# EAGLE design Puzzle Serial Bluetooth v0.9b (EAGLE 6.2)
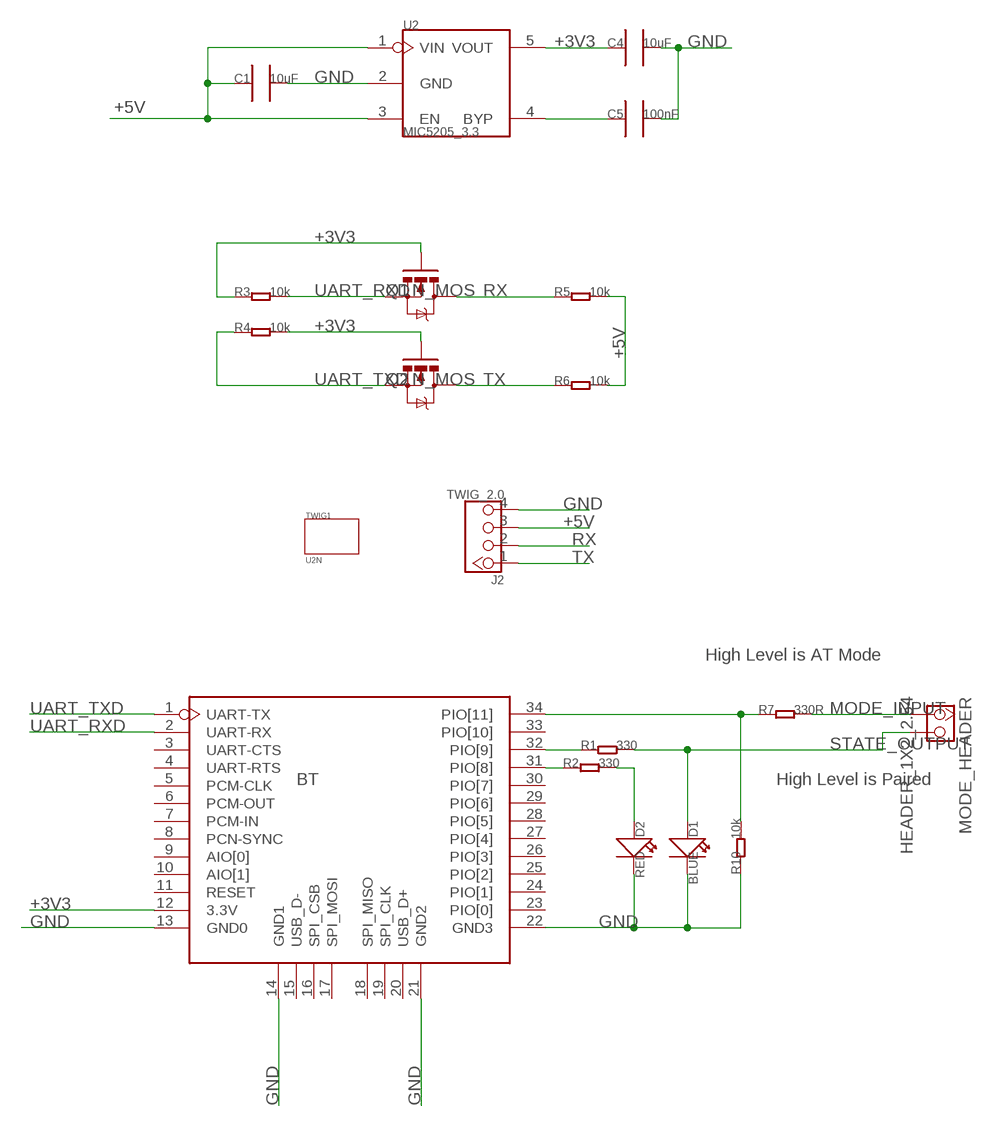
[diagram p0: schematic, sheet 1]

## Parts
BT  SERIAL_BLUETEETHSMT  [SERIAL_BLUETEETH]
C1  10uF  C0805_S  [0805_S]
C4  10uF  C0805_S  [0805_S]
C5  100nF  C0603_S  [0603_S]
D1  BLUE  LED0603_DD  [LED0603]
D2  RED  LED0603_DD  [LED0603]
J2  TWIG_2.0  [2.0_1X4]
MODE_HEADER  HEADER_1X2_2.54  [CK_1*2]
Q1  N_MOS  [SOT23]
Q2  N_MOS  [SOT23]
R1  330  R0603  [0603]
R2  330  R0603  [0603]
R3  10k  R0603_S  [0603_S]
R4  10k  R0603_S  [0603_S]
R5  10k  R0603_S  [0603_S]
R6  10k  R0603_S  [0603_S]
R7  330R  R0603_S  [0603_S]
R10  10k  R0603_S  [0603_S]
TWIG1  U2N  [U2N]
U2  MIC5205_3.3  MIC5025_X.X  [SOT23-5]

## Nets
+3V3: BT.12(3.3V) C4.1 Q1.1(G) Q2.1(G) R3.1 R4.2 U2.5(VOUT)
+5V: C1.1 J2.3 R5.2 R6.2 U2.1(VIN) U2.3(EN)
GND: BT.13(GND0) BT.14(GND1) BT.21(GND2) BT.22(GND3) C1.2 C4.2 C5.2 D1.2(-) D2.2(-) J2.4 R10.1 U2.2(GND)
MODE_INPUT: MODE_HEADER.1 R7.2
N$1: D2.1(+) R2.2
N$3: C5.1 U2.4(BYP)
N$6: BT.34(PIO[11]) R7.1 R10.2
N$7: BT.31(PIO[8]) R2.1
N$8: BT.32(PIO[9]) R1.1
RX: J2.2 Q1.3(D) R5.1
STATE_OUTPUT: D1.1(+) MODE_HEADER.2 R1.2
TX: J2.1 Q2.3(D) R6.1
UART_RXD: BT.2(UART-RX) Q1.2(S) R3.2
UART_TXD: BT.1(UART-TX) Q2.2(S) R4.1
Unconnected: BT.3(UART-CTS) BT.4(UART-RTS) BT.5(PCM-CLK) BT.6(PCM-OUT) BT.7(PCM-IN) BT.8(PCN-SYNC) BT.9(AIO[0]) BT.10(AIO[1]) BT.11(RESET) BT.15(USB_D-) BT.16(SPI_CSB) BT.17(SPI_MOSI) BT.18(SPI_MISO) BT.19(SPI_CLK) BT.20(USB_D+) BT.23(PIO[0]) BT.24(PIO[1]) BT.25(PIO[2]) BT.26(PIO[3]) BT.27(PIO[4]) BT.28(PIO[5]) BT.29(PIO[6]) BT.30(PIO[7]) BT.33(PIO[10])

## Notes on the sheet
- High Level is AT Mode
- High Level is Paired

## Library data of the parts
BT = EXT_moudle:SERIAL_BLUETEETH
C1 C4 = CPT_SMD:C0805
C5 = CPT_SMD:C0603
D1 D2 = CPT_SMD:LED0603
J2 = CONNECTER:TWIG_2.0
MODE_HEADER = CONNECTER:HEADER_1X2
Q1 Q2 = CPT_SMD:N_MOS
R1-R7 R10 = CPT_SMD:R0603
TWIG1 = twig_template1:U2N
U2 = ICs_v54:MIC5025_X.X

## Net classes
0 default: width 0.203 mm, drill 0.305 mm, clearance 0.203 mm

## Board
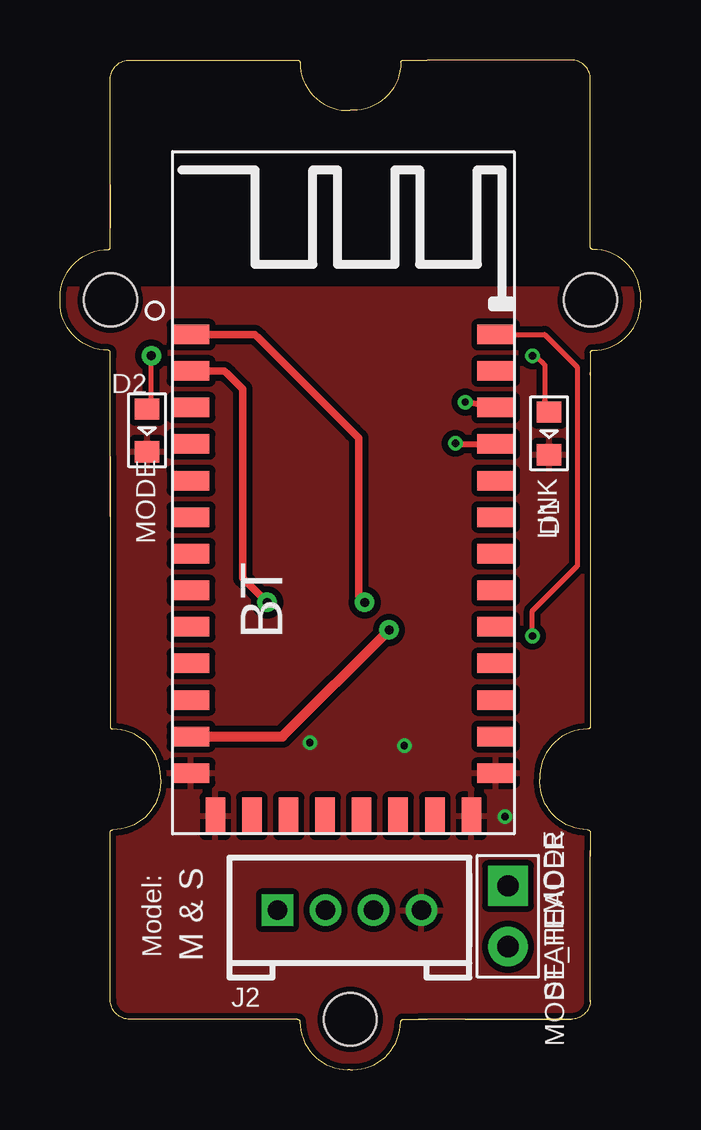
[diagram p1: board, top side]
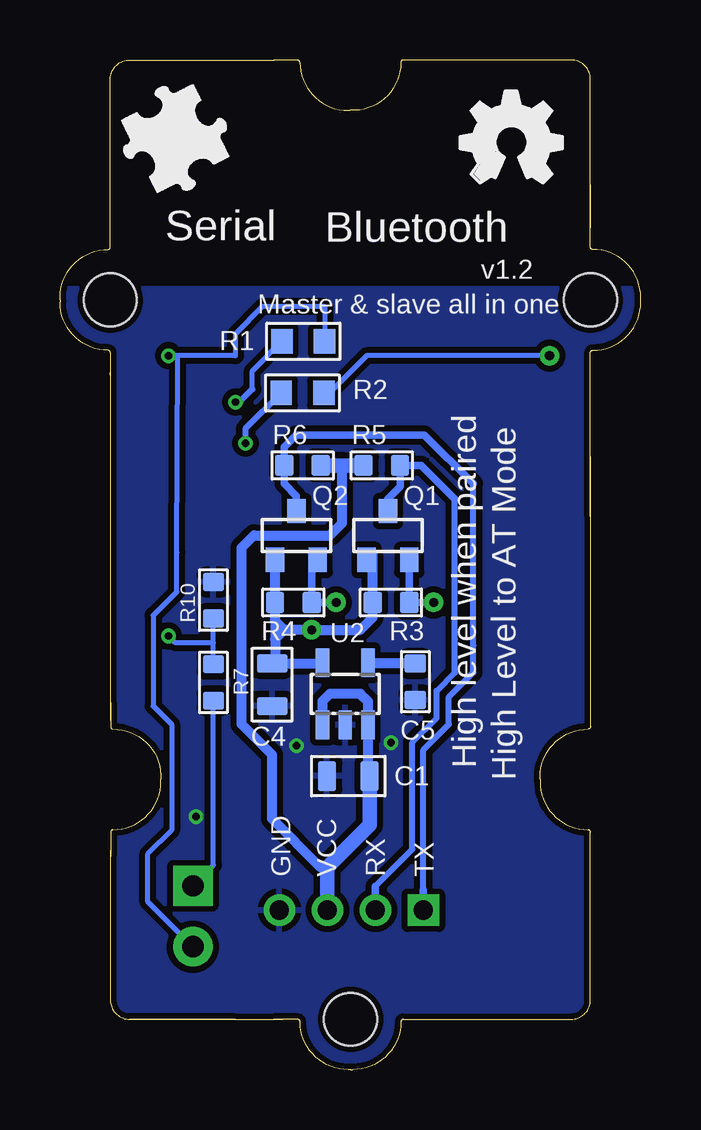
[diagram p2: board, bottom side, seen from below]

Size 24.2 x 42.09 mm. Coordinates in mm from the lower left corner, seen from the top.
Copper layers (1*16): Top 0.035mm / dielectric 1.5mm / Bottom 0.035mm
Design rules: minimum track width 6mil, minimum drill 12mil, track to track 6mil, track to pad 6mil, pad to pad 6mil, via to via 6mil, smd to smd 0mil, copper to edge 10mil, drill to drill 10mil, minimum pad ring 10mil, minimum via ring 6mil, stop-mask expansion 2mil, vias tented up to drill 100mil, thermal gap 10mil

### Footprints (pad centres in the part's own frame; a part is rotated, then mirrored left to right if it is on the bottom)
SERIAL_BLUETEETH = smd 1.524 x 0.813: 1 -6.35,0; 2 -6.35,-1.524; 3 -6.35,-3.048; 4 -6.35,-4.572; 5 -6.35,-6.096; 6 -6.35,-7.62; 7 -6.35,-9.144; 8 -6.35,-10.668; 9 -6.35,-12.192; 10 -6.35,-13.716; 11 -6.35,-15.24; 12 -6.35,-16.764; 13 -6.35,-18.288; 22 6.35,-18.288; 23 6.35,-16.764; 24 6.35,-15.24; 25 6.35,-13.716; 26 6.35,-12.192; 27 6.35,-10.668; 28 6.35,-9.144; 29 6.35,-7.62; 30 6.35,-6.096; 31 6.35,-4.572; 32 6.35,-3.048; 33 6.35,-1.524; 34 6.35,0 | smd 0.813 x 1.524: 14 -5.334,-20.066; 15 -3.81,-20.066; 16 -2.286,-20.066; 17 -0.762,-20.066; 18 0.762,-20.066; 19 2.286,-20.066; 20 3.81,-20.066; 21 5.334,-20.066
0805_S = smd 0.762 x 1.27: 1 -0.889,0; 2 0.889,0
0603_S = smd 0.762 x 0.889: 1 -0.762,0; 2 0.762,0
LED0603 = smd 0.889 x 1.016: 1 -0.889,0; 2 0.889,0
2.0_1X4 = drill 0.8 pad 1.27 square: 1 -3,0 | drill 0.8 pad 1.27: 2 -1,0; 3 1,0; 4 3,0
CK_1*2 = drill 0.889 pad 1.651 square: 1 0,1.27 | drill 0.889 pad 1.651: 2 0,-1.27
SOT23 = smd 0.762 x 1.016: 1 -0.889,-1.016; 2 0.889,-1.016; 3 0,1.016
0603 = smd 0.889 x 1.016: 1 -0.889,0; 2 0.889,0
U2N = hole 2.2: 10.453,-10.42; 10.453,9.58; -19.535,-0.415
SOT23-5 = smd 0.55 x 1.2: 1 -0.95,-1.3; 2 0,-1.3; 3 0.95,-1.3; 4 0.95,1.3; 5 -0.95,1.3

### Placement (x,y rotation side)
BT  11.81,30.65 0 top
C1  12.19,12.24 180 bottom
C4  15.36,16.05 270 bottom
C5  9.39,16.17 270 bottom
D1  20.38,26.52 270 top
D2  3.63,26.65 270 top
J2  12.06,6.65 0 top
MODE_HEADER  18.66,6.4 0 top
Q1  10.54,22.27 0 bottom
Q2  14.35,22.27 0 bottom
R1  14.06,30.37 0 bottom
R2  14.09,28.21 0 bottom
R3  10.41,19.48 0 bottom
R4  14.47,19.48 180 bottom
R5  10.79,25.19 180 bottom
R6  14.09,25.19 0 bottom
R7  17.81,16.14 270 bottom
R10  17.81,19.57 270 bottom
TWIG1  11.68,21.64 90 top
U2  12.31,15.67 0 bottom
U$1  [BRICK-LOGO-MIL-0.5]  21.94,36.27 0 bottom
U$2  [OPHW-LOGO-FILL-150]  7.52,36.97 0 bottom

### Tracks (layer width: path | path; a pad name or v marks a point on that pad's centre or on a via)
+3V3  (via drill 0.38 pad 0.81)
  Top 0.254: BT.12 4.82,13.89
  Top 0.406: BT.12 9.27,13.89 v13.71,18.33
  Bottom 0.406: U2.5 13.29,16.94 15.24,16.94 | 15.24,16.94 C4.1 | Q1.1 11.17,21.51 R3.1 11.17,18.84 11.68,18.33 v13.71,18.33 14.85,18.33 | 15.24,18.71 R4.2 Q2.1 | 15.24,18.71 15.24,17.95 | 15.24,17.95 15.24,16.94 | 14.85,18.33 15.24,18.71 | 14.85,18.33 15.24,17.95
+5V
  Bottom 0.305: 12.44,25.19 R5.2
  Bottom 0.406: U2.1 13.26,15.35 12.95,15.67 11.68,15.67 11.36,15.35 U2.3 11.36,12.3 C1.1 | 12.44,25.19 12.44,22.78 12.95,22.27 16.12,22.27 16.63,21.76 16.63,14.4 15.36,13.13 15.36,10.46 13.35,8.44 13.06,8.44
  Bottom 0.61: R6.2 12.44,25.19 R5.2 | J2.3 13.06,8.44 11.3,10.21 C1.1
GND  (via drill 0.3)
  other vias: 14.35,13.51 10.41,13.63 18.54,10.55
  pour Top (isolate 0.254): -0.23,-0.97 -0.35,32.56 24.54,32.56 24.54,-0.84
  pour Bottom (isolate 0.254): -0.23,-0.97 -0.35,32.56 24.54,32.56 24.54,-0.84
MODE_INPUT
  Bottom 0.203: MODE_HEADER.1 17.81,8.52 R7.2
N$1  (via drill 0.38 pad 0.81)
  Top 0.203: v3.81,29.76 3.81,27.88 D2.1
  Bottom 0.203: R2.2 12.98,28.21 11.43,29.76 v3.81,29.76
N$3
  Bottom 0.406: C5.1 11.33,16.94 U2.4
N$6  (via drill 0.3)
  Top 0.203: BT.34 20.19,30.65 21.55,29.29 21.55,21 19.68,19.13 v19.68,18.08
  Bottom 0.203: R7.1 17.81,17.79 | 17.81,17.79 R10.2 | 17.81,17.79 19.39,17.79 v19.68,18.08
N$7  (via drill 0.3)
  Top 0.254: v16.47,26.11 16.51,26.08 BT.31
  Bottom 0.254: R2.1 16.47,26.72 v16.47,26.11
N$8  (via drill 0.3)
  Top 0.254: BT.32 v16.89,27.83
  Bottom 0.203: 16.19,28.37 16.19,29.13 R1.1
  Bottom 0.254: v16.89,27.83 16.73,27.83 16.19,28.37
RX
  Bottom 0.254: 11.06,7.65 9.52,9.19 9.52,13.63 8.5,14.65 8.5,15.79 7.74,16.55 7.74,17.95 7.74,23.79
  Bottom 0.305: Q1.3 10.54,23.79 10.03,24.3 R5.1 9.14,25.19 7.74,23.79 | J2.2 11.06,7.65
STATE_OUTPUT  (via drill 0.3)
  Top 0.203: v19.68,29.76 19.81,29.76 20.19,29.38 20.19,27.89 D1.1
  Bottom 0.203: R1.2 13.17,31.83 15.74,31.83 16.89,30.68 16.89,29.76 v19.68,29.76 19.3,29.76 19.33,21.57 19.33,19.92 20.32,18.94 20.32,15.16 19.55,14.4 19.55,9.98 20.54,9 20.54,7 MODE_HEADER.2
TX
  Bottom 0.254: 9.06,7.49 9.06,13.33 8,14.4 8,15.54 6.98,16.55 6.98,17.7 6.98,24.43
  Bottom 0.305: Q2.3 14.35,23.92 14.85,24.43 R6.1 14.85,25.95 14.35,26.46 9.01,26.46 6.98,24.43 | J2.1 9.06,7.49
UART_RXD  (via drill 0.38 pad 0.81)
  Top 0.305: v8.63,19.48 7.62,20.49 7.62,28.37 6.98,29 6.85,29.13 BT.2
  Bottom 0.305: Q1.2 R3.2 v8.63,19.48
UART_TXD  (via drill 0.38 pad 0.81)
  Top 0.305: v12.7,19.48 12.44,19.73 12.44,26.33 12.19,26.59 8.25,30.53 8.12,30.65 BT.1
  Bottom 0.305: Q2.2 13.71,21.51 R4.1 v12.7,19.48

### Text on the board
tPlace: MODE | LINK | MODE | STATE | Model: | M & S
bPlace: Bluetooth | Serial | v1.2 | Master & slave all in one | High Level to AT Mode | High level when paired | TX | RX | VCC | GND